# EAGLE schematic skematik_rangkaian_node (EAGLE 9.2.0)
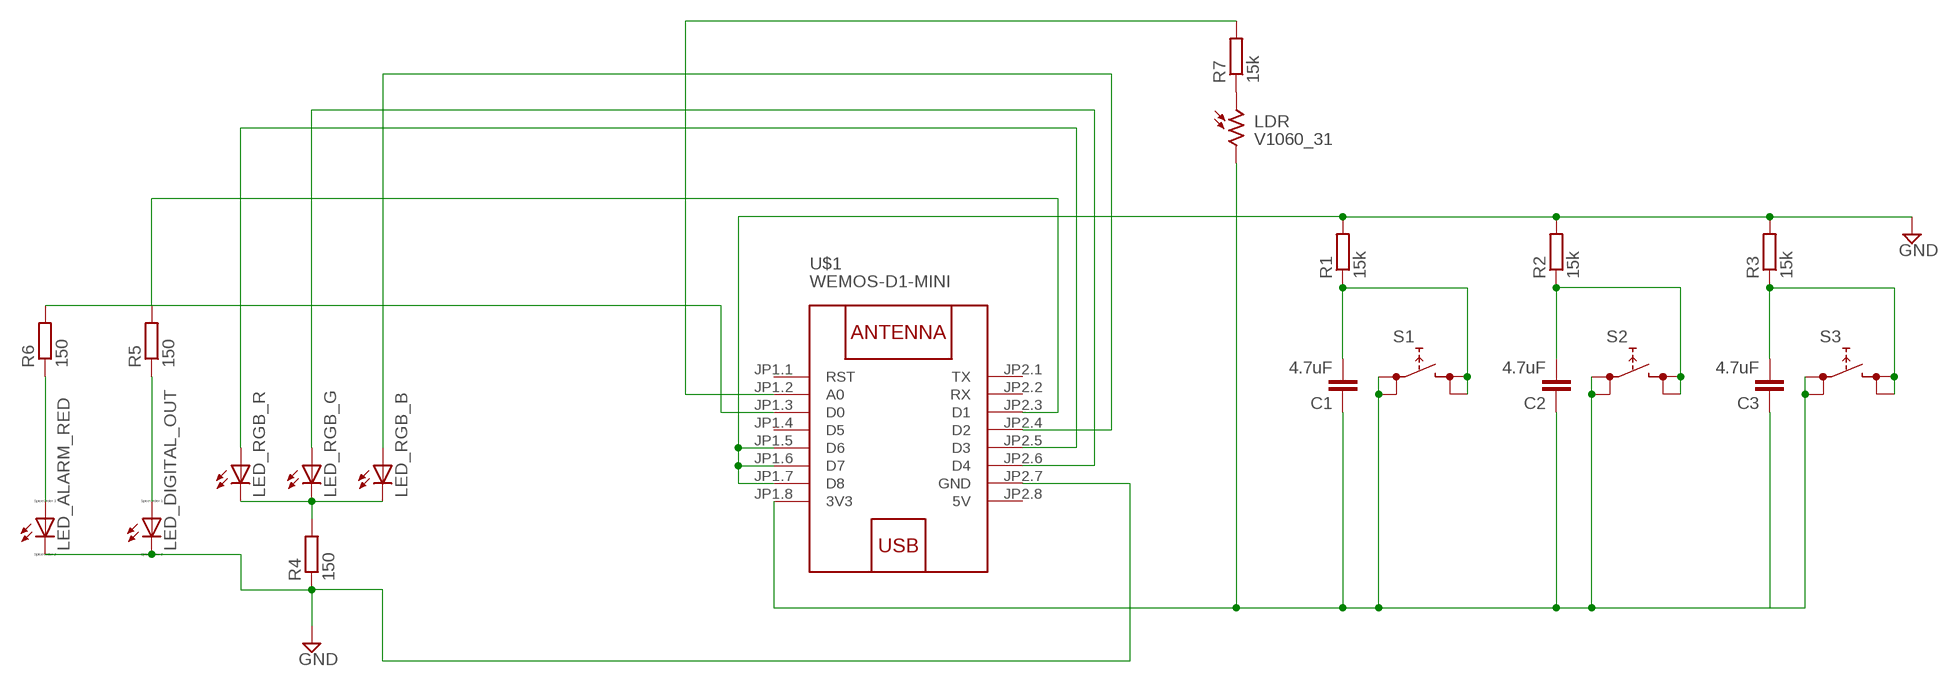
[diagram p0: schematic, sheet 1]

## Parts
C1  4.7uF  C5/5.5  [C5B5.5]
C2  4.7uF  C5/5.5  [C5B5.5]
C3  4.7uF  C5/5.5  [C5B5.5]
LDR  V1060_31  [TO-5_V10]
LED_ALARM_RED  LED_E  [LED_1206]
LED_DIGITAL_OUT  LED_E  [LED_1206]
LED_RGB_  GM5WA94310A  [GM5WA94310A]
R1  15k  R-EU_0204/2V  [0204V]
R2  15k  R-EU_0204/2V  [0204V]
R3  15k  R-EU_0204/2V  [0204V]
R4  150  R-EU_0204/2V  [0204V]
R5  150  R-EU_0204/2V  [0204V]
R6  150  R-EU_0204/2V  [0204V]
R7  15k  R-EU_0204/2V  [0204V]
S1  REKN  [REKN]
S2  REKN  [REKN]
S3  REKN  [REKN]
U$1  WEMOS-D1-MINI  [WEMOS-D1-MINI]

## Nets
GND: LED_ALARM_RED.C LED_DIGITAL_OUT.C R1.2 R2.2 R3.2 R4.1 U$1.JP1.5(D6) U$1.JP1.6(D7) U$1.JP1.7(D8) U$1.JP2.7(GND)
N$1: R6.2 U$1.JP1.3(D0)
N$2: R5.2 U$1.JP2.3(D1)
N$3: LED_RGB_.2(R:A) U$1.JP2.5(D3)
N$4: LED_RGB_.3(G:A) U$1.JP2.6(D4)
N$5: LED_RGB_.1(B:A) U$1.JP2.4(D2)
N$6: C1.1 C2.1 C3.1 LDR.2 S1.0A S1.0B S2.0A S2.0B S3.0A S3.0B U$1.JP1.8(3V3)
N$7: C1.2 R1.1 S1.1A S1.1B
N$8: C2.2 R2.1 S2.1A S2.1B
N$9: C3.2 R3.1 S3.1A S3.1B
N$10: LED_DIGITAL_OUT.A R5.1
N$11: LED_RGB_.4(G:C) LED_RGB_.5(R:C) LED_RGB_.6(B:C) R4.2
N$12: LED_ALARM_RED.A R6.1
N$13: LDR.1 R7.1
N$14: R7.2 U$1.JP1.2(A0)
Unconnected: U$1.JP1.1(RST) U$1.JP1.4(D5) U$1.JP2.1(TX) U$1.JP2.2(RX)

## Power pins joined to a net without a drawn wire
5V: U$1.JP2.8(5V)

## Library data of the parts
C1-C3 = capacitor-wima:C: CAPACITOR naming: grid - package width
LDR = photo-elements:?1060*: Sensor Street Light control Source: http://optoelectronics.perkinelmer.com/content/Datasheets/DTS_PhotocellsB1060.pdf
LED_ALARM_RED LED_DIGITAL_OUT = eagle-ltspice:LED_E: LED Source: http://www.osram.convergy.de Source: www.luxeon.com Source: www.kingbright.com; SPICEMODEL: NONE; SPICEPREFIX: D; SPICETYPE: diode
LED_RGB_ = led:GM5WA94310A: Chip LED RGB Source: http://document.sharpsma.com/files/GM5WA94310A_SS.pdf
R1-R7 = rcl:R-EU_: RESISTOR, European symbol; SPICEPREFIX: R
S1-S3 = switch:REKN: PUSH SWITCH ITT-Cannon-Cannon
U$1 = diy-modules:WEMOS-D1-MINI: WEMOS D1 mini: Mini Wi-Fi Board based on ESP-8266 device More details can be found here: https://www.wemos.cc/product/d1-mini.html Click here to find device on ebay.com <http://www.ebay.com/sch/wemos+d1+mini+nodemcu>